# EAGLE design M101A (EAGLE 6.6.0)
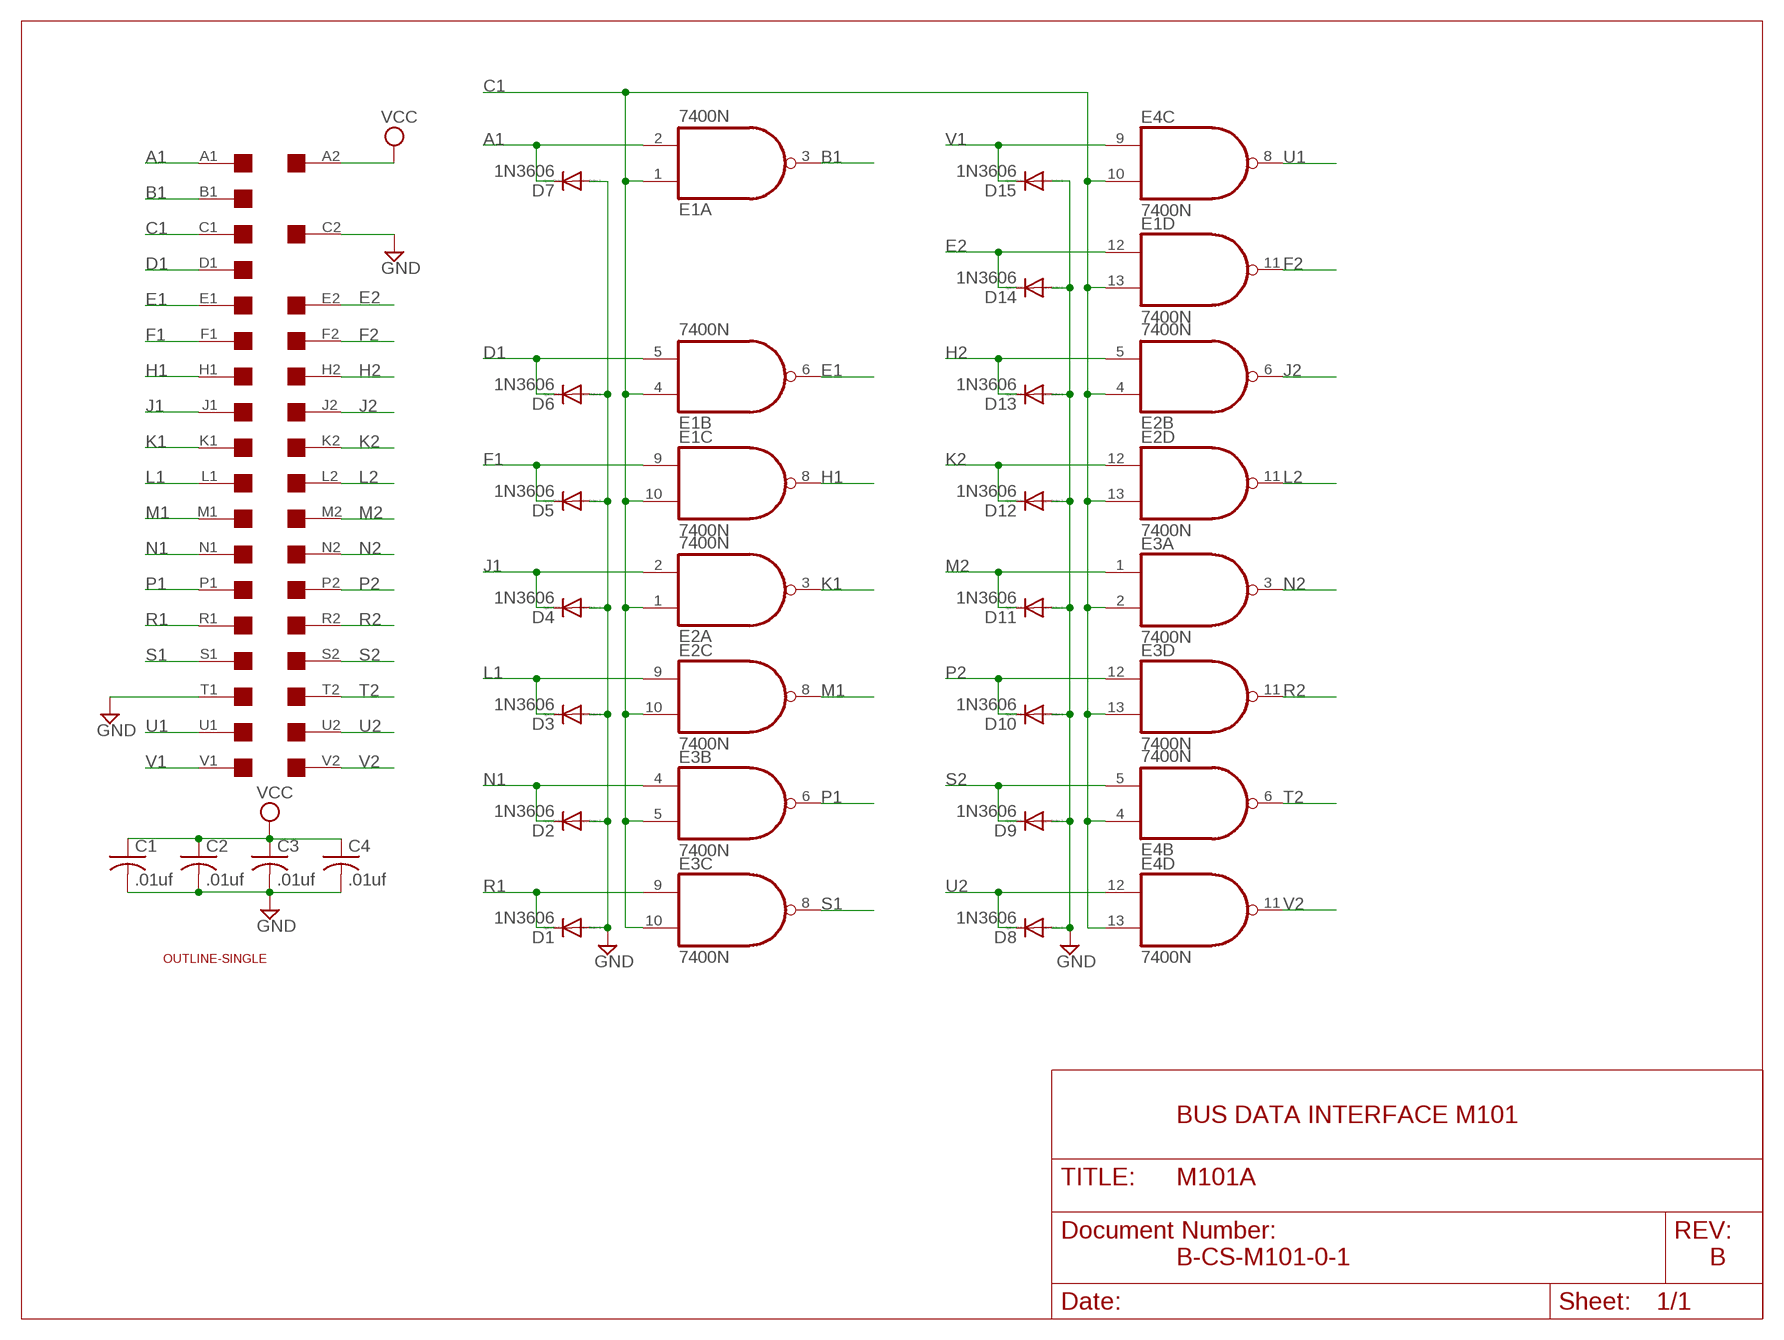
[diagram p0: schematic, sheet 1]

## Parts
C1  .01uf  C-US050-025X075  [C050-025X075]
C2  .01uf  C-US050-025X075  [C050-025X075]
C3  .01uf  C-US050-025X075  [C050-025X075]
C4  .01uf  C-US050-025X075  [C050-025X075]
D1  1N3606  1N4148DO35-10  [DO35-10]
D2  1N3606  1N4148DO35-10  [DO35-10]
D3  1N3606  1N4148DO35-10  [DO35-10]
D4  1N3606  1N4148DO35-10  [DO35-10]
D5  1N3606  1N4148DO35-10  [DO35-10]
D6  1N3606  1N4148DO35-10  [DO35-10]
D7  1N3606  1N4148DO35-10  [DO35-10]
D8  1N3606  1N4148DO35-10  [DO35-10]
D9  1N3606  1N4148DO35-10  [DO35-10]
D10  1N3606  1N4148DO35-10  [DO35-10]
D11  1N3606  1N4148DO35-10  [DO35-10]
D12  1N3606  1N4148DO35-10  [DO35-10]
D13  1N3606  1N4148DO35-10  [DO35-10]
D14  1N3606  1N4148DO35-10  [DO35-10]
D15  1N3606  1N4148DO35-10  [DO35-10]
E1  7400N  [DIL14]
E2  7400N  [DIL14]
E3  7400N  [DIL14]
E4  7400N  [DIL14]
U$1  SINGLE  [EDGE-CON2]
U$4  OUTLINE-SINGLE  [SINGLE]

## Nets
A1: D7.C E1.2(A:I1) U$1.A1
B1: E1.3(A:O) U$1.B1
C1: E1.1(A:I0) E1.4(B:I0) E1.10(C:I1) E1.13(D:I1) E2.1(A:I0) E2.4(B:I0) E2.10(C:I1) E2.13(D:I1) E3.2(A:I1) E3.5(B:I1) E3.10(C:I1) E3.13(D:I1) E4.4(B:I0) E4.10(C:I1) E4.13(D:I1) U$1.C1
D1: D6.C E1.5(B:I1) U$1.D1
E1: E1.6(B:O) U$1.E1
E2: D14.C E1.12(D:I0) U$1.E2
F1: D5.C E1.9(C:I0) U$1.F1
F2: E1.11(D:O) U$1.F2
GND [Supply]: C1.2 C2.2 C3.2 C4.2 D1.A D2.A D3.A D4.A D5.A D6.A D7.A D8.A D9.A D10.A D11.A D12.A D13.A D14.A D15.A U$1.C2 U$1.T1
H1: E1.8(C:O) U$1.H1
H2: D13.C E2.5(B:I1) U$1.H2
J1: D4.C E2.2(A:I1) U$1.J1
J2: E2.6(B:O) U$1.J2
K1: E2.3(A:O) U$1.K1
K2: D12.C E2.12(D:I0) U$1.K2
L1: D3.C E2.9(C:I0) U$1.L1
L2: E2.11(D:O) U$1.L2
M1: E2.8(C:O) U$1.M1
M2: D11.C E3.1(A:I0) U$1.M2
N1: D2.C E3.4(B:I0) U$1.N1
N2: E3.3(A:O) U$1.N2
P1: E3.6(B:O) U$1.P1
P2: D10.C E3.12(D:I0) U$1.P2
R1: D1.C E3.9(C:I0) U$1.R1
R2: E3.11(D:O) U$1.R2
S1: E3.8(C:O) U$1.S1
S2: D9.C E4.5(B:I1) U$1.S2
T2: E4.6(B:O) U$1.T2
U1: E4.8(C:O) U$1.U1
U2: D8.C E4.12(D:I0) U$1.U2
V1: D15.C E4.9(C:I0) U$1.V1
V2: E4.11(D:O) U$1.V2
VCC [Supply]: C1.1 C2.1 C3.1 C4.1 U$1.A2
Unconnected: E4.1(A:I0) E4.2(A:I1) E4.3(A:O) U$1.B2 U$1.D2

## Notes on the sheet
- BUS DATA INTERFACE M101
- B-CS-M101-0-1 | B

## Power pins joined to a net without a drawn wire
GND: E1.7(P:GND) E2.7(P:GND) E3.7(P:GND) E4.7(P:GND)
VCC: E1.14(P:VCC) E2.14(P:VCC) E3.14(P:VCC) E4.14(P:VCC)

## Library data of the parts
C1-C4 = rcl:C-US: CAPACITOR, American symbol
D1-D15 = diode:1N4148: DIODE high speed (Philips)
E1-E4 = 74xx-us:74*00: Quad 2-input NAND gate
U$1 = dec-con:SINGLE: Single-Height DEC board
U$4 = dec-con:OUTLINE-*: Board outlines for DEC boards.

## Net classes
1 Supply: width 0.813 mm

## Board
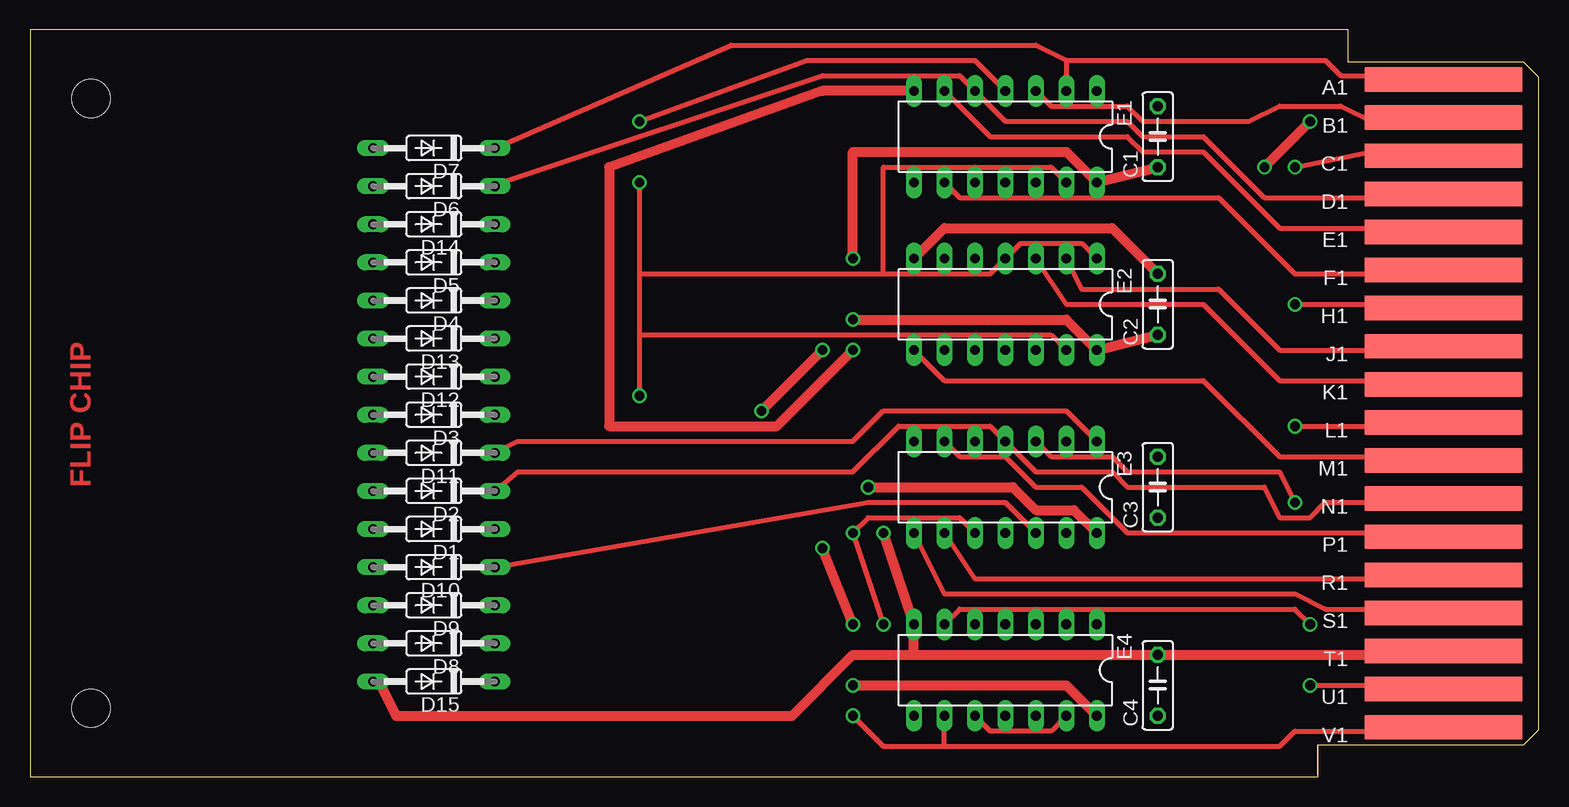
[diagram p1: board, top side]
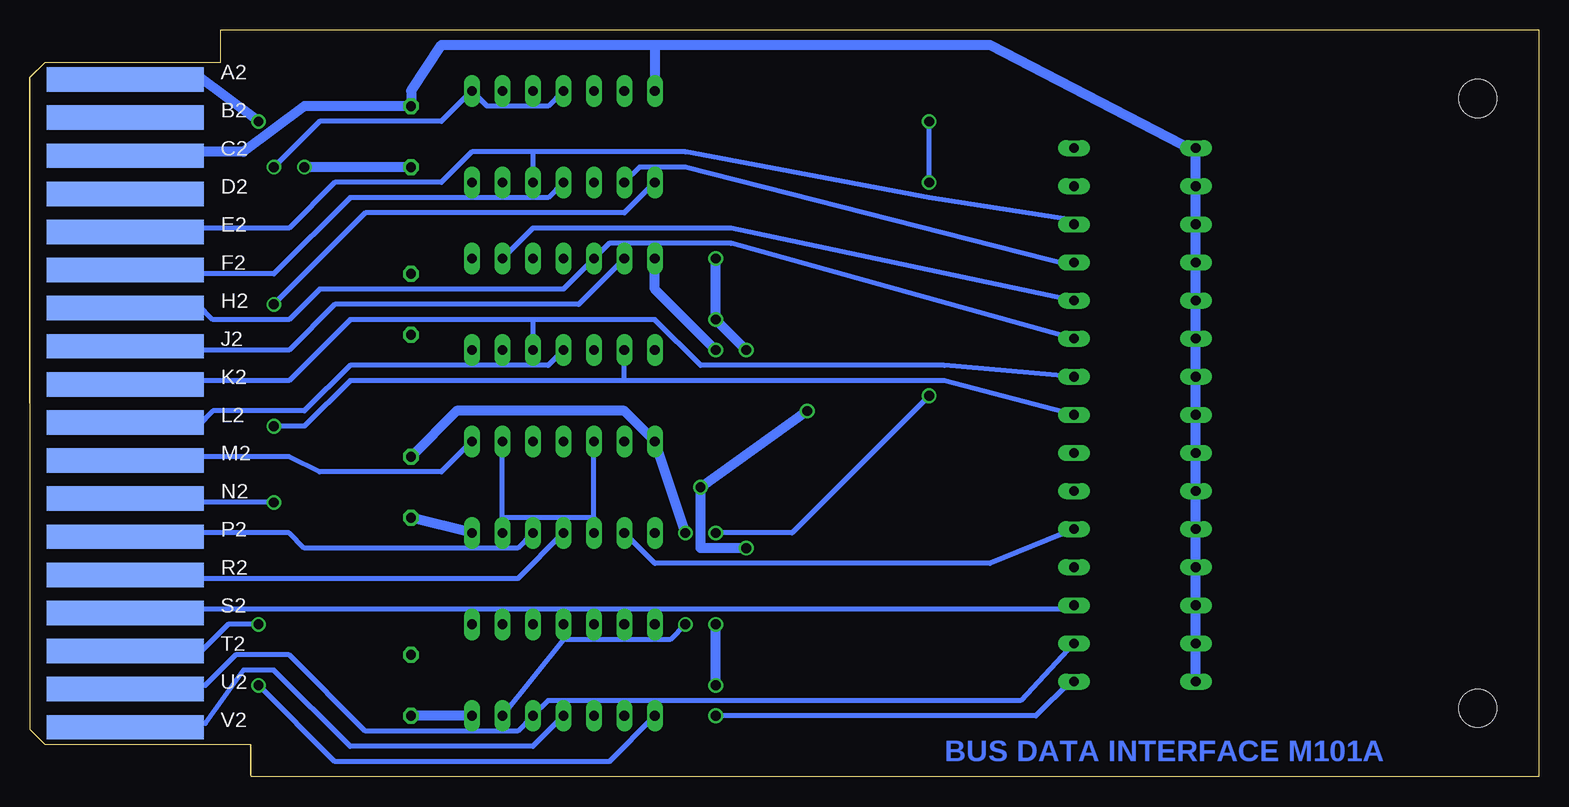
[diagram p2: board, bottom side, seen from below]

Size 125.73 x 62.23 mm. Coordinates in mm from the lower left corner, seen from the top.
Copper layers (1+16): Top 0.035mm / dielectric 1.5mm / Bottom 0.035mm
Design rules "16mils": minimum track width 16mil, minimum drill 32mil, track to track 15mil, track to pad 10mil, pad to pad 10mil, via to via 10mil, smd to smd 10mil, copper to edge 13mil, drill to drill 10mil, minimum pad ring 10mil, minimum via ring 8mil, stop-mask expansion 0mil, vias tented up to drill 0mil, thermal gap 10mil

### Footprints (pad centres in the part's own frame; a part is rotated, then mirrored left to right if it is on the bottom)
C050-025X075 = drill 0.813 octagon: 1 -2.54,0; 2 2.54,0
DO35-10 = drill 0.813 long: A 5.08,0; C -5.08,0
DIL14 = drill 0.813 long: 1 -7.62,-3.81; 2 -5.08,-3.81; 3 -2.54,-3.81; 4 0,-3.81; 5 2.54,-3.81; 6 5.08,-3.81; 7 7.62,-3.81; 8 7.62,3.81; 9 5.08,3.81; 10 2.54,3.81; 11 0,3.81; 12 -2.54,3.81; 13 -5.08,3.81; 14 -7.62,3.81
EDGE-CON2 = smd 13.106 x 2.032: A1 7.938,4.128; B1 7.938,7.303; C1 7.938,10.477; D1 7.938,13.652; E1 7.938,16.828; F1 7.938,20.003; H1 7.938,23.177; J1 7.938,26.352; K1 7.938,29.527; L1 7.938,32.703; M1 7.938,35.877; N1 7.938,39.053; P1 7.938,42.227; R1 7.938,45.403; S1 7.938,48.578; T1 7.938,51.752; U1 7.938,54.928; V1 7.938,58.102 | smd 13.106 x 2.032 bottom: A2 7.938,4.128; B2 7.938,7.303; C2 7.938,10.477; D2 7.938,13.652; E2 7.938,16.828; F2 7.938,20.003; H2 7.938,23.177; J2 7.938,26.352; K2 7.938,29.527; L2 7.938,32.703; M2 7.938,35.877; N2 7.938,39.053; P2 7.938,42.227; R2 7.938,45.403; S2 7.938,48.578; T2 7.938,51.752; U2 7.938,54.928; V2 7.938,58.102
SINGLE = hole 3.175: 120.65,56.515; 120.65,5.715

### Placement (x,y rotation side)
C1  93.98,53.34 90 top
C2  93.98,39.37 90 top
C3  93.98,24.13 90 top
C4  93.98,7.62 90 top
D1  33.66,20.64 180 top
D2  33.66,23.81 180 top
D3  33.66,30.16 180 top
D4  33.66,39.69 180 top
D5  33.66,42.86 180 top
D6  33.66,49.21 180 top
D7  33.66,52.39 180 top
D8  33.66,11.11 180 top
D9  33.66,14.29 180 top
D10  33.66,17.46 180 top
D11  33.66,26.99 180 top
D12  33.66,33.34 180 top
D13  33.66,36.51 180 top
D14  33.66,46.04 180 top
D15  33.66,7.94 180 top
E1  81.28,53.34 180 top
E2  81.28,39.37 180 top
E3  81.28,24.13 180 top
E4  81.28,8.89 180 top
U$1  125.73,62.23 180 top
U$4  125.73,62.23 180 top

### Tracks (layer width: path | path; a pad name or v marks a point on that pad's centre or on a via)
A1
  Top 0.406: U$1.A1 111.76,58.42 109.22,58.42 107.95,59.69 86.36,59.69 | 86.36,59.69 E1.2 | D7.C 58.42,60.96 83.82,60.96 86.36,59.69
B1
  Top 0.406: U$1.B1 111.76,54.61 109.22,55.88 104.14,55.88 101.6,54.61 92.71,54.61 91.44,55.88 85.09,55.88 E1.3
C1  (via drill 0.81)
  Top 0.406: E4.10 80.01,3.81 85.09,3.81 E4.13 | U$1.C1 111.76,52.07 v105.41,50.8 | E1.4 78.74,59.69 64.77,59.69 v50.8,54.61 | 78.74,50.8 85.09,50.8 E1.13 | v50.8,31.75 50.8,36.83 | 50.8,36.83 50.8,41.91 | 50.8,41.91 v50.8,49.53 | v71.12,12.7 v68.58,20.32 69.85,21.59 77.47,21.59 E3.10 | 78.74,50.8 E1.10 | 78.74,50.8 71.12,50.8 71.12,41.91 | 50.8,41.91 71.12,41.91 | 71.12,41.91 80.01,41.91 E2.4 82.55,44.45 87.63,44.45 E2.1 | E2.13 85.09,36.83 78.74,36.83 | 78.74,36.83 E2.10 | 50.8,36.83 78.74,36.83
  Bottom 0.406: E1.4 82.55,55.88 87.63,55.88 E1.1 91.44,54.61 101.6,54.61 v105.41,50.8 | v50.8,49.53 v50.8,54.61 | E3.10 78.74,21.59 | 78.74,21.59 E3.5 | 86.36,21.59 E3.13 | 78.74,21.59 86.36,21.59 | 86.36,21.59 E3.2 | 81.28,11.43 72.39,11.43 v71.12,12.7 | 81.28,11.43 E4.4 | 81.28,11.43 E4.13 | v68.58,20.32 62.23,20.32 v50.8,31.75
D1
  Top 0.406: U$1.D1 111.76,48.26 102.87,48.26 97.79,53.34 92.71,53.34 91.44,54.61 81.28,54.61 E1.5 77.47,58.42 66.04,58.42 39.37,49.53 D6.C
E1
  Top 0.406: U$1.E1 111.76,45.72 104.14,45.72 97.79,52.07 92.71,52.07 91.44,53.34 80.01,53.34 E1.6
E2
  Bottom 0.406: U$1.E2 111.76,45.72 104.14,45.72 100.33,49.53 91.44,49.53 88.9,52.07 83.82,52.07 | 83.82,52.07 E1.12 | 83.82,52.07 71.12,52.07 50.8,48.26 38.73,46.35 D14.C
F1
  Top 0.406: U$1.F1 113.03,41.91 105.41,41.91 99.06,48.26 77.47,48.26 E1.9
  Bottom 0.406: E1.9 74.93,50.8 71.12,50.8 38.73,42.55 D5.C
F2
  Bottom 0.406: U$1.F2 111.76,41.91 105.41,41.91 99.06,48.26 82.55,48.26 E1.11
GND  (via drill 0.81)
  Top 0.813: 73.66,10.16 C4.2 111.76,10.16 112.09,10.49 U$1.T1 | 73.66,10.16 68.58,10.16 63.5,5.08 30.48,5.08 29.21,7.62 28.89,7.94 D15.A | 73.66,10.16 E4.7 v71.12,20.32 | E2.7 76.2,45.72 90.17,45.72 C2.2 | E1.7 66.04,57.15 48.26,50.8 48.26,29.21 62.23,29.21 v68.58,35.56
  Bottom 0.813: 28.57,52.07 D6.A D14.A D5.A D4.A | 28.57,52.07 D7.A | D15.A D8.A D9.A D10.A D1.A | 28.57,24.13 D2.A | 28.57,24.13 D11.A D3.A D12.A D13.A D4.A | U$1.C2 112.09,51.74 111.76,52.07 107.95,52.07 102.87,55.88 C1.2 93.98,57.15 91.44,60.96 73.66,60.96 | 73.66,60.96 E1.7 | 73.66,60.96 45.72,60.96 28.57,52.07 | D1.A 28.57,20.95 | D1.A 28.57,24.13 | D4.A 28.57,40.01 | v71.12,20.32 E3.7 76.2,30.48 90.17,30.48 C3.2 | v68.58,35.56 73.66,40.64 E2.7
H1  (via drill 0.81)
  Top 0.406: U$1.H1 111.76,39.37 v105.41,39.37
  Bottom 0.406: v105.41,39.37 97.79,46.99 76.2,46.99 E1.8
H2
  Bottom 0.406: U$1.H2 111.76,39.37 110.49,38.1 104.14,38.1 101.6,40.64 81.28,40.64 E2.5 77.47,44.45 67.31,44.45 D13.C
J1
  Top 0.406: U$1.J1 111.76,35.56 104.14,35.56 99.06,40.64 87.63,40.64 E2.2
  Bottom 0.406: D4.C 67.31,45.72 83.82,45.72 E2.2
J2
  Bottom 0.406: U$1.J2 111.76,35.56 104.14,35.56 100.33,39.37 80.01,39.37 E2.6
K1
  Top 0.406: U$1.K1 111.76,33.02 104.14,33.02 97.79,39.37 86.36,39.37 E2.3
K2
  Bottom 0.406: U$1.K2 111.76,33.02 104.14,33.02 99.06,38.1 83.82,38.1 | 83.82,38.1 E2.12 | 83.82,38.1 73.66,38.1 69.85,34.29 49.53,34.29 D12.C
L1  (via drill 0.81)
  Top 0.406: U$1.L1 111.76,29.21 v105.41,29.21
  Bottom 0.406: D3.C 49.53,33.02 76.2,33.02 | 76.2,33.02 E2.9 | 76.2,33.02 99.06,33.02 102.87,29.21 v105.41,29.21
L2
  Bottom 0.406: U$1.L2 111.76,29.21 110.49,30.48 102.87,30.48 99.06,34.29 82.55,34.29 E2.11
M1
  Top 0.406: U$1.M1 111.76,26.67 104.14,26.67 97.79,33.02 76.2,33.02 E2.8
M2
  Top 0.406: D11.C 40.64,27.94 68.58,27.94 71.12,30.48 86.36,30.48 E3.1
  Bottom 0.406: U$1.M2 111.76,26.67 104.14,26.67 101.6,25.4 91.44,25.4 E3.1
N1
  Top 0.406: D2.C 40.64,25.4 68.58,25.4 72.39,29.21 80.01,29.21 E3.4 83.82,25.4 90.17,25.4 91.44,24.13 102.87,24.13 104.14,21.59 106.68,21.59 107.95,22.86 111.76,22.86 U$1.N1
N2  (via drill 0.81)
  Top 0.406: v105.41,22.86 104.14,25.4 91.44,25.4 90.17,26.67 85.09,26.67 E3.3
  Bottom 0.406: U$1.N2 111.76,22.86 v105.41,22.86
P1
  Top 0.406: U$1.P1 111.76,20.32 91.44,20.32 87.63,24.13 83.82,24.13 81.28,26.67 77.47,26.67 E3.6
P2
  Top 0.406: D10.C 40.64,17.78 69.85,22.86 81.28,22.86 E3.12
  Bottom 0.406: U$1.P2 111.76,20.32 104.14,20.32 102.87,19.05 85.09,19.05 E3.12
R1
  Top 0.406: U$1.R1 111.76,16.51 78.74,16.51 E3.9
  Bottom 0.406: D1.C 45.72,17.78 73.66,17.78 E3.9
R2
  Bottom 0.406: U$1.R2 111.76,16.51 85.09,16.51 E3.11
S1
  Top 0.406: U$1.S1 111.76,13.97 107.95,13.97 105.41,15.24 76.2,15.24 E3.8
S2
  Bottom 0.406: U$1.S2 111.76,13.97 78.74,13.97 | 78.74,13.97 E4.5 | D9.C 38.73,13.97 78.74,13.97
T2  (via drill 0.81)
  Top 0.406: v106.68,12.7 105.41,13.97 77.47,13.97 E4.6
  Bottom 0.406: U$1.T2 111.76,10.16 109.22,12.7 v106.68,12.7
U1  (via drill 0.81)
  Top 0.406: U$1.U1 112.12,7.26 111.76,7.62 v106.68,7.62
  Bottom 0.406: v106.68,7.62 100.33,1.27 77.47,1.27 E4.8
U2
  Bottom 0.406: D8.C 43.18,6.35 82.55,6.35 E4.12 85.09,3.81 97.79,3.81 104.14,10.16 108.58,10.16 111.12,7.62 U$1.U2
V1  (via drill 0.81)
  Top 0.406: U$1.V1 111.76,4.2 111.76,3.81 105.41,3.81 104.14,2.54 76.2,2.54 | 76.2,2.54 E4.9 | v68.58,5.08 71.12,2.54 76.2,2.54
  Bottom 0.406: D15.C 39.05,7.94 41.91,5.08 v68.58,5.08
V2
  Bottom 0.406: U$1.V2 111.12,4.45 107.95,8.89 105.41,8.89 99.06,2.54 83.82,2.54 E4.11
VCC  (via drill 0.81)
  Top 0.813: C2.1 E2.14 86.36,38.1 v68.58,38.1 | C1.1 E1.14 86.36,52.07 68.58,52.07 v68.58,43.18 | v102.87,50.8 v106.68,54.61 | E4.14 86.36,7.62 v68.58,7.62 | v68.58,12.7 v66.04,19.05 | E3.14 87,22.23 83.82,22.23 81.92,24.13 v69.85,24.13 | v60.96,30.48 v66.04,35.56
  Bottom 0.813: C1.1 v102.87,50.8 | U$1.A2 111.76,58.42 v106.68,54.61 | E3.14 C3.1 | E4.14 C4.1 | v68.58,7.62 v68.58,12.7 | v66.04,19.05 69.85,19.05 v69.85,24.13 v60.96,30.48 | v66.04,35.56 v68.58,38.1 v68.58,43.18

### Text on the board
Top: FLIP CHIP
Bottom: BUS DATA INTERFACE M101A